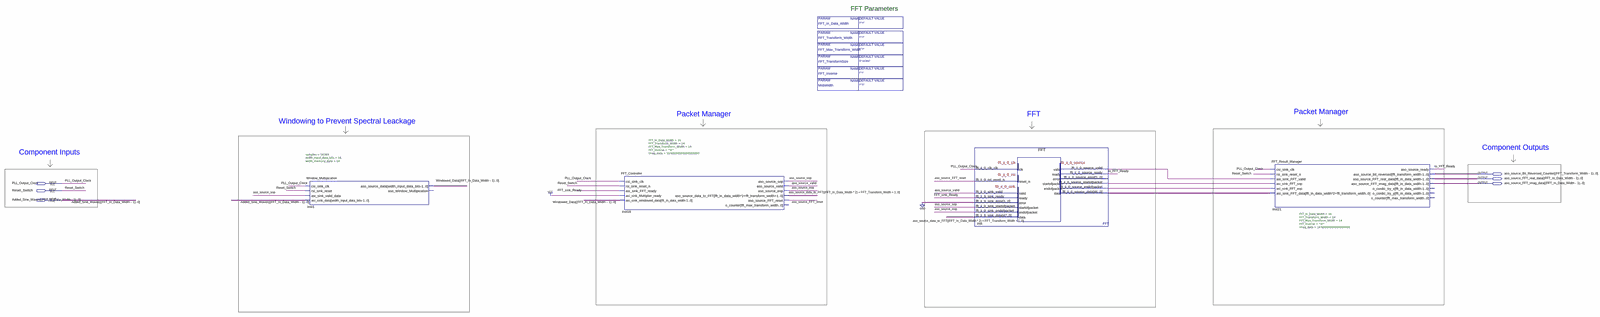
[diagram p0: schematic sheet, whole]
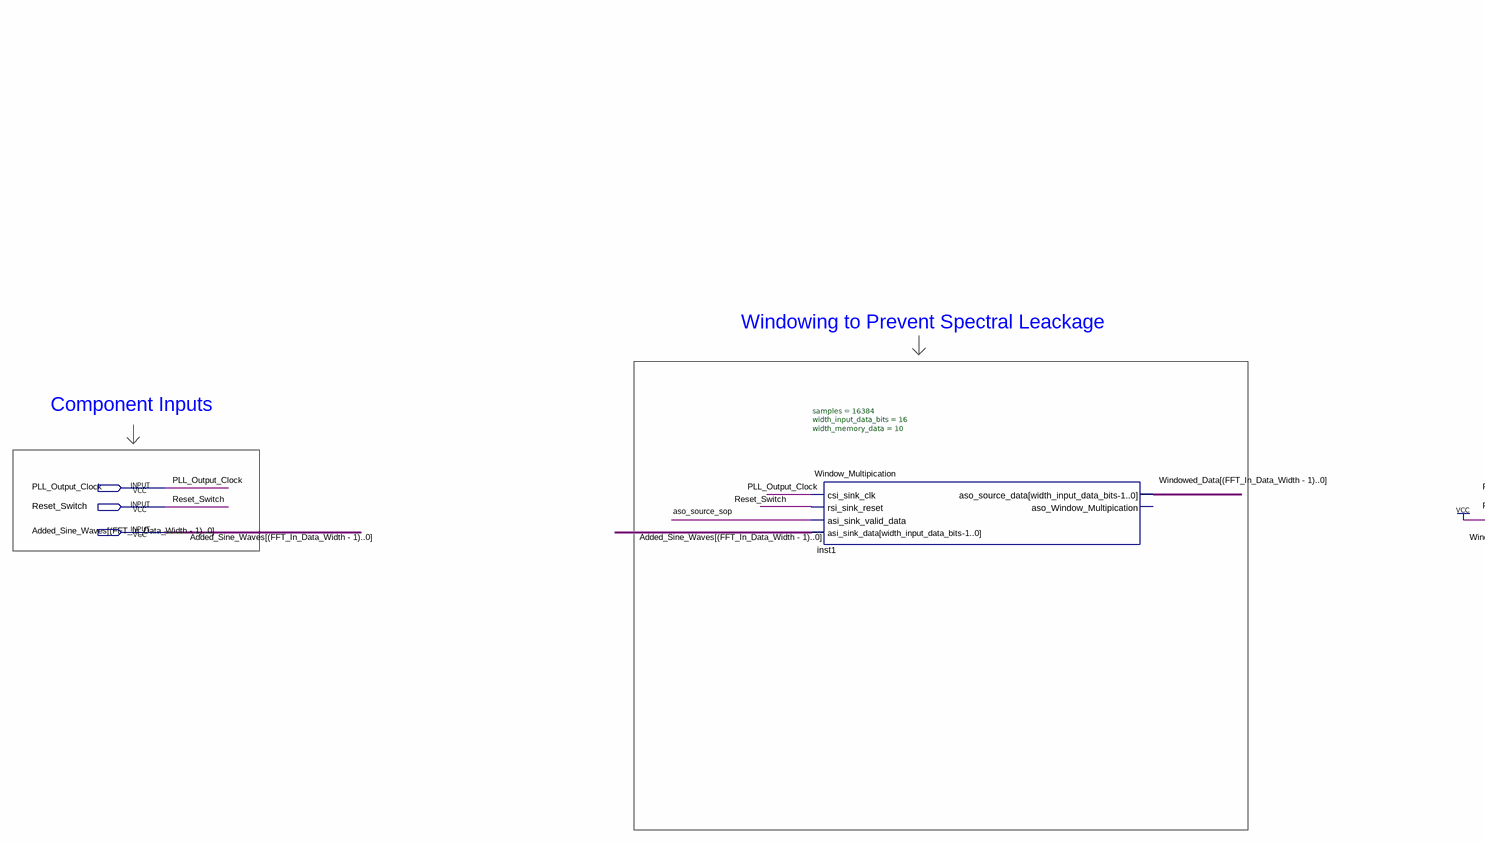
[diagram p1: schematic sheet, left part]
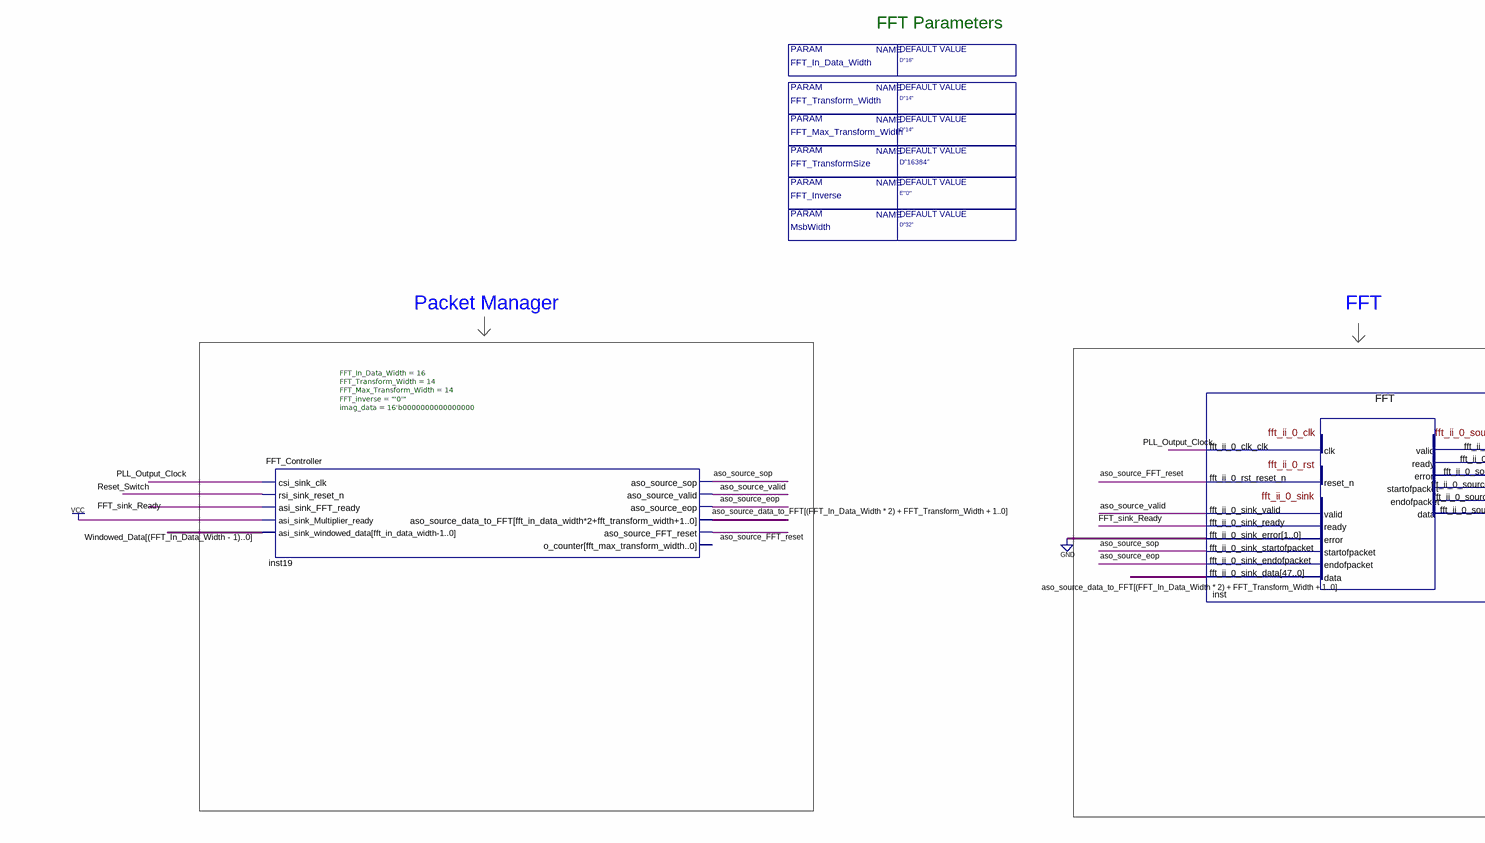
[diagram p2: schematic sheet, centre part]
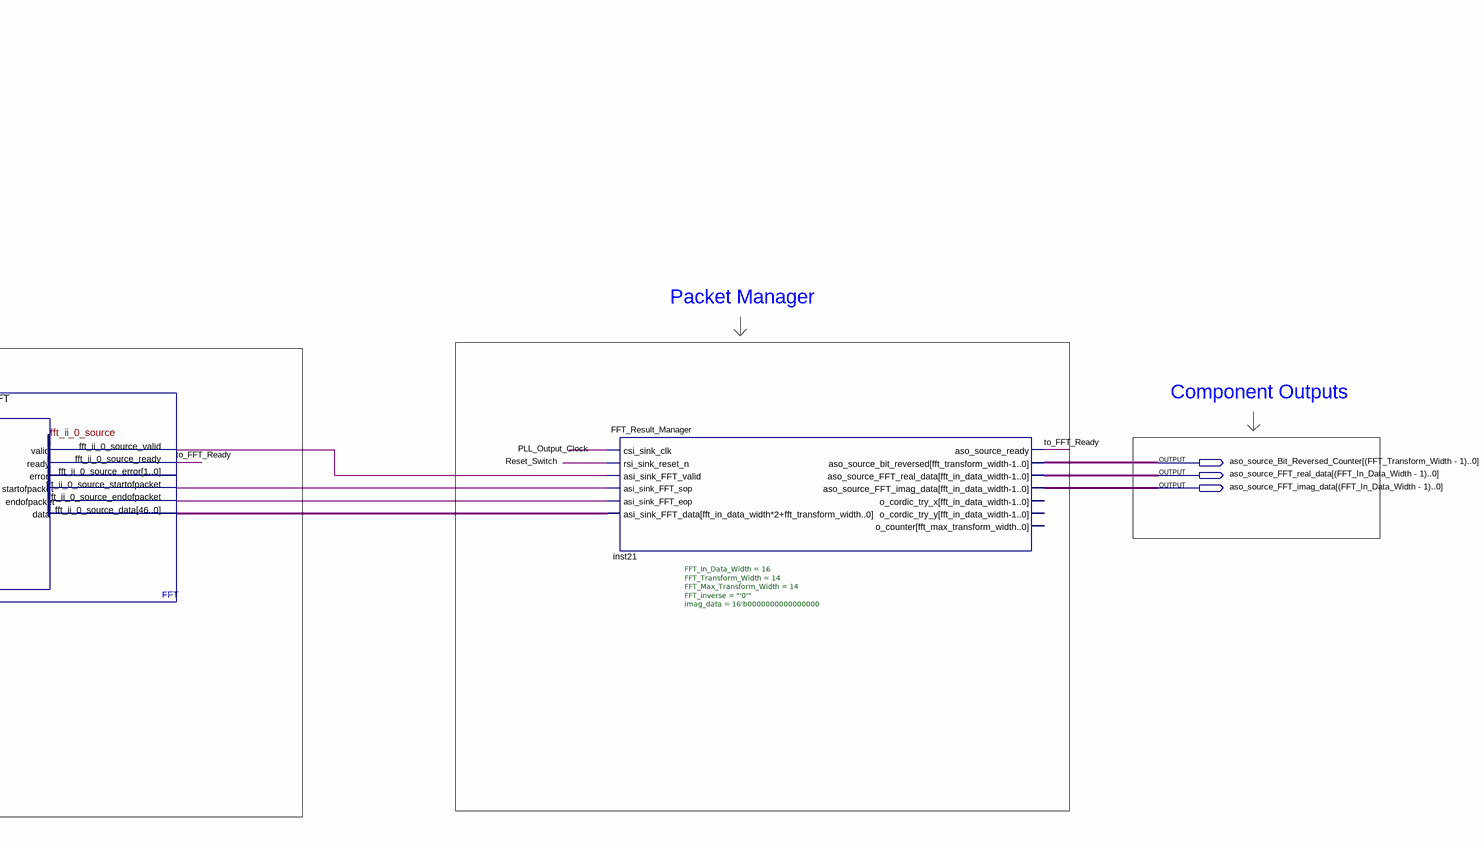
[diagram p3: schematic sheet, right part]
// Quartus schematic FFT_Compenent.bdf as structural Verilog: 4 symbols, 6 pins
module FFT_Compenent #(parameter FFT_Inverse = "E\"'0'\"", parameter FFT_In_Data_Width = "D\"16\"", parameter FFT_Transform_Width = "D\"14\"", parameter FFT_Max_Transform_Width = "D\"14\"", parameter FFT_TransformSize = "D\"16384\"", parameter MsbWidth = "D\"32\"") (
  input  PLL_Output_Clock,
  input  Reset_Switch,
  input  \Added_Sine_Waves[(FFT_In_Data_Width_-_1)..0] ,
  output \aso_source_Bit_Reversed_Counter[(FFT_Transform_Width_-_1)..0] ,
  output \aso_source_FFT_real_data[(FFT_In_Data_Width_-_1)..0] ,
  output \aso_source_FFT_imag_data[(FFT_In_Data_Width_-_1)..0] 
);

  wire \aso_source_data_to_FFT[(FFT_In_Data_Width_*_2)_+_FFT_Transform_Width_+_1..0] , aso_source_eop,
       aso_source_FFT_reset, aso_source_sop, aso_source_valid, FFT_sink_Ready,
       inst_fft_ii_0_source_endofpacket, inst_fft_ii_0_source_startofpacket, inst_fft_ii_0_source_valid,
       to_FFT_Ready, \Windowed_Data[(FFT_In_Data_Width_-_1)..0] ;
  wire [13:0] inst21_aso_source_bit_reversed;
  wire [15:0] inst21_aso_source_fft_imag_data, inst21_aso_source_fft_real_data;
  wire [46:0] inst_fft_ii_0_source_data;

  Window_Multipication #(.samples(16384), .width_input_data_bits(16), .width_memory_data(10)) inst1 (
    .csi_sink_clk(PLL_Output_Clock), .rsi_sink_reset(Reset_Switch), .asi_sink_valid_data(aso_source_sop),
    .asi_sink_data({16{\Added_Sine_Waves[(FFT_In_Data_Width_-_1)..0] }}),
    .aso_source_data(\Windowed_Data[(FFT_In_Data_Width_-_1)..0] ));  // open: aso_Window_Multipication
  FFT_Controller #(.FFT_In_Data_Width(16), .FFT_Transform_Width(14), .FFT_Max_Transform_Width(14), .FFT_inverse("'0'"), .imag_data(16'b0000000000000000)) inst19 (
    .csi_sink_clk(PLL_Output_Clock), .rsi_sink_reset_n(Reset_Switch), .asi_sink_FFT_ready(FFT_sink_Ready),
    .asi_sink_Multiplier_ready(1'b1),
    .asi_sink_windowed_data({16{\Windowed_Data[(FFT_In_Data_Width_-_1)..0] }}),
    .aso_source_sop(aso_source_sop), .aso_source_valid(aso_source_valid), .aso_source_eop(aso_source_eop),
    .aso_source_data_to_FFT(\aso_source_data_to_FFT[(FFT_In_Data_Width_*_2)_+_FFT_Transform_Width_+_1..0] ),
    .aso_source_FFT_reset(aso_source_FFT_reset));  // open: o_counter
  FFT inst (
    .fft_ii_0_clk_clk(PLL_Output_Clock), .fft_ii_0_rst_reset_n(aso_source_FFT_reset),
    .fft_ii_0_sink_valid(aso_source_valid), .fft_ii_0_sink_error(2'b00),
    .fft_ii_0_sink_startofpacket(aso_source_sop), .fft_ii_0_sink_endofpacket(aso_source_eop),
    .fft_ii_0_sink_data({48{\aso_source_data_to_FFT[(FFT_In_Data_Width_*_2)_+_FFT_Transform_Width_+_1..0] }}),
    .fft_ii_0_source_ready(to_FFT_Ready), .fft_ii_0_sink_ready(FFT_sink_Ready),
    .fft_ii_0_source_valid(inst_fft_ii_0_source_valid),
    .fft_ii_0_source_startofpacket(inst_fft_ii_0_source_startofpacket),
    .fft_ii_0_source_endofpacket(inst_fft_ii_0_source_endofpacket),
    .fft_ii_0_source_data(inst_fft_ii_0_source_data));  // open: fft_ii_0_source_error
  FFT_Result_Manager #(.FFT_In_Data_Width(16), .FFT_Transform_Width(14), .FFT_Max_Transform_Width(14), .FFT_inverse("'0'"), .imag_data(16'b0000000000000000)) inst21 (
    .csi_sink_clk(PLL_Output_Clock), .rsi_sink_reset_n(Reset_Switch),
    .asi_sink_FFT_valid(inst_fft_ii_0_source_valid), .asi_sink_FFT_sop(inst_fft_ii_0_source_startofpacket),
    .asi_sink_FFT_eop(inst_fft_ii_0_source_endofpacket), .asi_sink_FFT_data(inst_fft_ii_0_source_data),
    .aso_source_ready(to_FFT_Ready), .aso_source_bit_reversed(inst21_aso_source_bit_reversed),
    .aso_source_FFT_real_data(inst21_aso_source_fft_real_data),
    .aso_source_FFT_imag_data(inst21_aso_source_fft_imag_data));  // open: o_cordic_try_x, o_cordic_try_y, o_counter

  // Notes on the sheet:
  //   FFT Parameters
  //   Packet Manager  
  //   Packet Manager  
  //   FFT
  //   Windowing to Prevent Spectral Leackage     
  //   Component Outputs   
  //   Component Inputs   
endmodule
